# EAGLE design zigbee_iNEMO (EAGLE 9.6.0)

## Sheet 1 of 3
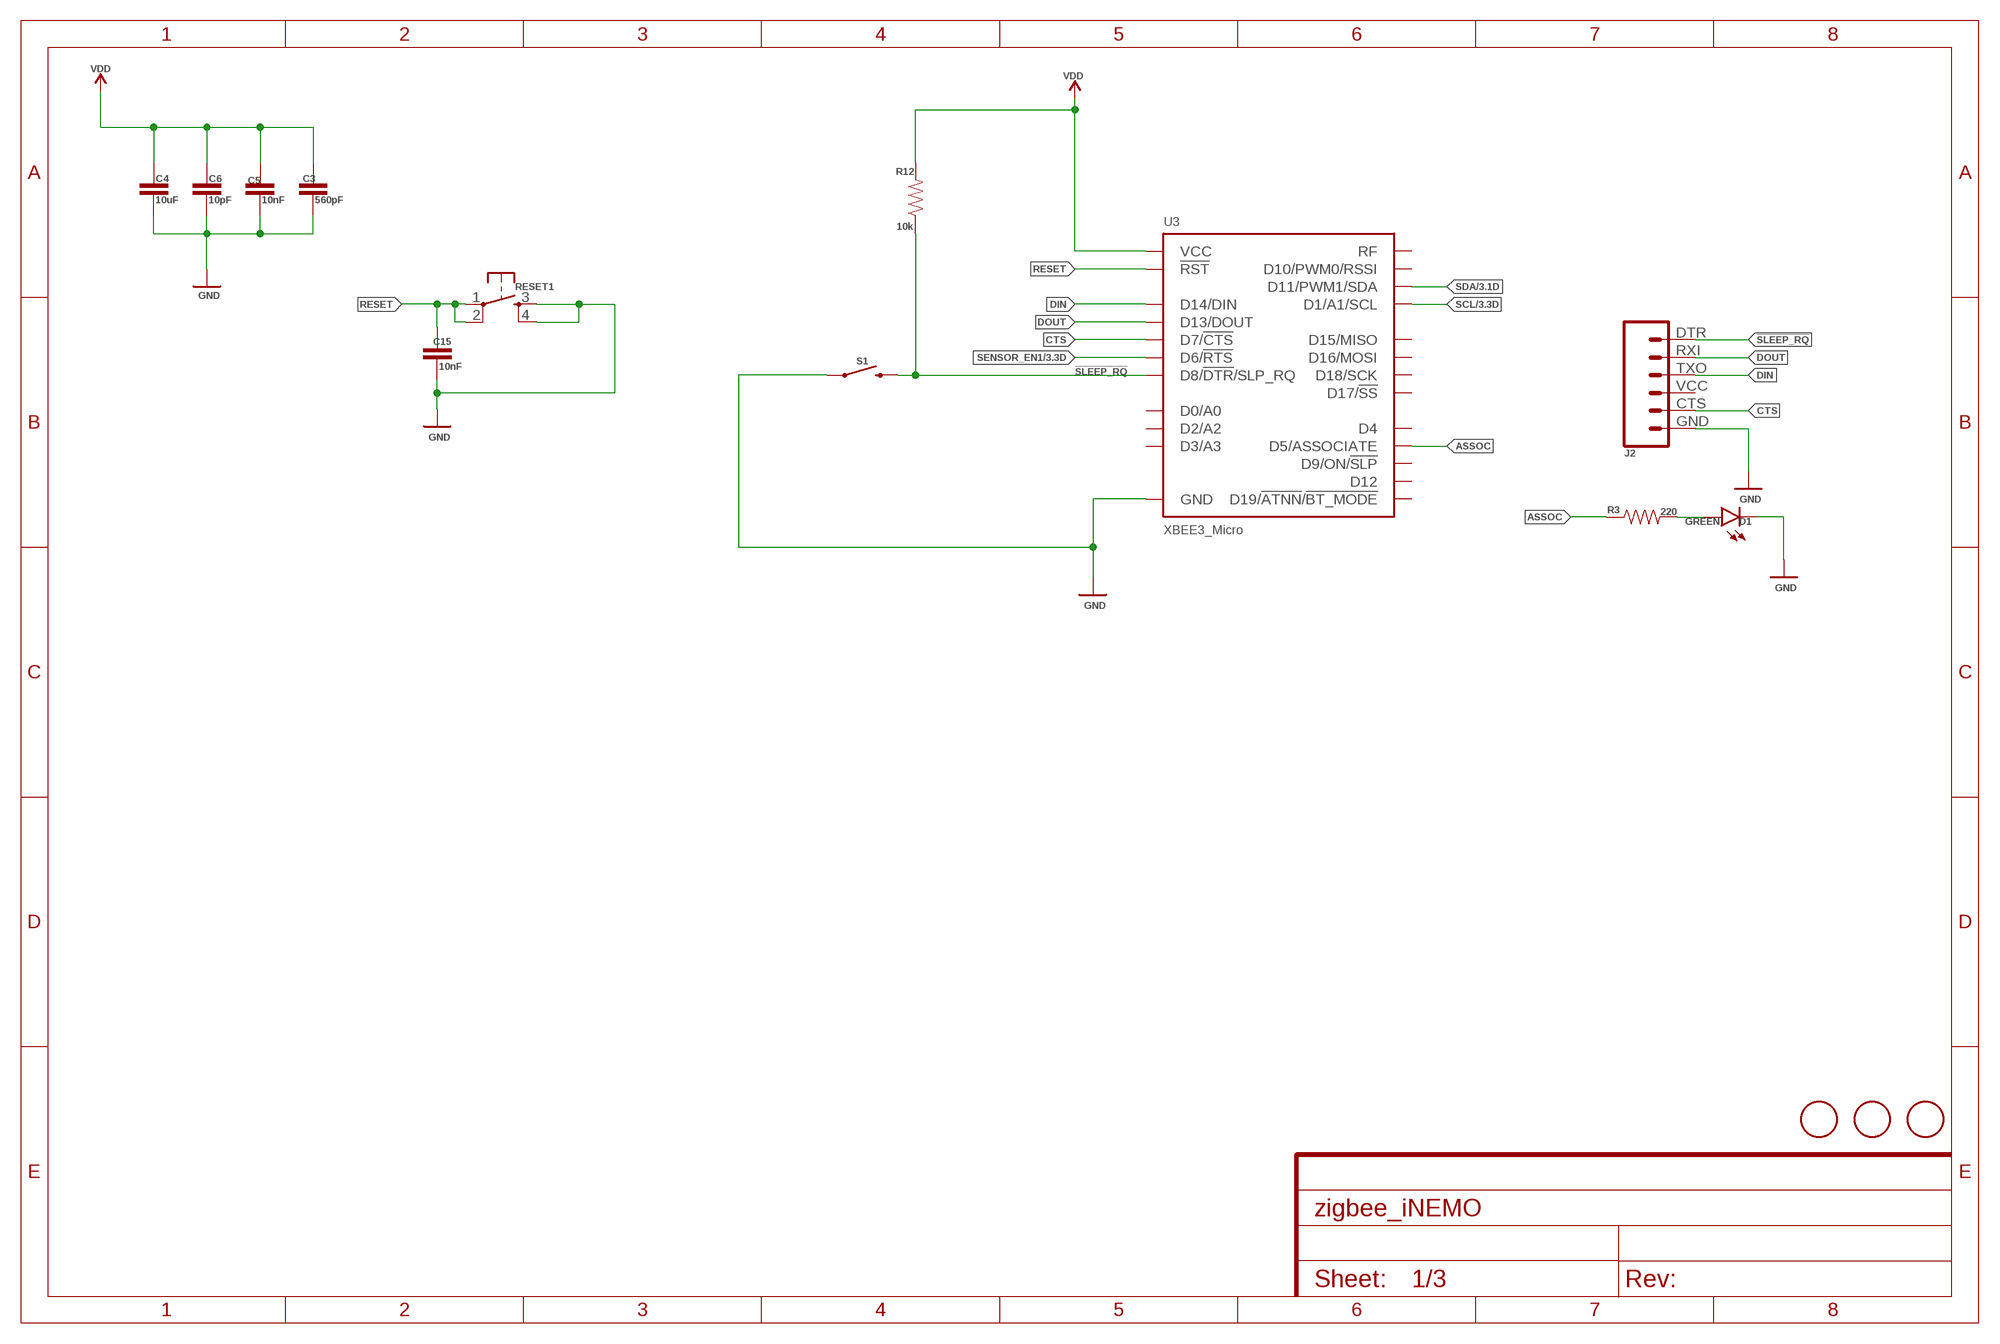
[diagram p0: schematic, sheet 1]

### Parts
C3  560pF  560PF-0603-50V-5%  [0603]
C4  10uF  10UF-0603-6.3V-20%  [0603]
C5  10nF  10NF-0603-50V-10%  [0603]
C6  10pF  10PF-0603-50V-5%  [0603]
C15  10nF  10NF-0603-50V-10%  [0603]
D1  GREEN  LED-GREEN0603  [LED-0603]
J2  6_PIN_SERIAL_CABLEPTH  [FTDI_BASIC]
R3  220  220OHM-0603-1/10W-1%  [0603]
R12  10k  10KOHM-0603-1/10W-1%  [0603]
RESET1  MOMENTARY-SWITCH-SPST-2-SMD-4.6X2.8MM  [TACTILE_SWITCH_SMD_4.6X2.8MM]
S1  MOMENTARY-SWITCH-SPST-SMD-4.6X2.8MM  [TACTILE_SWITCH_SMD_4.6X2.8MM]
U3  XBEE3_Micro  XBEE3_THING_PLUS_SPARKFUN-RF_XBEE3  [XBEE3_THING_PLUS_SPARKFUN-RF_XBEE3]
U$5  FIDUCIAL  [FIDUCIAL_1MM]
U$6  FIDUCIAL  [FIDUCIAL_1MM]
U$7  FIDUCIAL  [FIDUCIAL_1MM]

### Nets
!SLEEP_RQ: J2.DTR R12.1 S1.3 S1.4 U3.P$9(D8/!DTR!/SLP_RQ)
ASSOC: R3.1 U3.P$26(D5/ASSOCIATE)
CTS: J2.CTS U3.P$24(D7/!CTS)
DIN: J2.TXO U3.P$4(D14/DIN)
DOUT: J2.RXI U3.P$3(D13/DOUT)
GND: C3.1 C4.1 C5.1 C6.1 C15.1 D1.C J2.GND RESET1.3 RESET1.4 S1.1 S1.2 U3.P$1(GND) U3.P$10(GND) U3.P$12(GND) U3.P$21(GND) U3.P$32(GND) U3.P$34(GND) ; also sheet 2,3
N$1: D1.A R3.2
RESET: C15.2 RESET1.1 RESET1.2 U3.P$6(!RST)
SCL: U3.P$30(D1/A1/SCL) ; also sheet 3
SDA: U3.P$8(D11/PWM1/SDA) ; also sheet 3
SENSOR_EN1: U3.P$27(D6/!RTS) ; also sheet 3
VDD: C3.2 C4.2 C5.2 C6.2 R12.2 U3.P$2(VCC) ; also sheet 2,3
Unconnected: J2.VCC U3.P$5(D12) U3.P$7(D10/PWM0/RSSI) U3.P$11(D19/!ATNN!/!BT_MODE) U3.P$13(D18/SCK) U3.P$14(D17/!SS) U3.P$15(D16/MOSI) U3.P$16(D15/MISO) U3.P$23(D4) U3.P$25(D9/ON/!SLP) U3.P$28(D3/A3) U3.P$29(D2/A2) U3.P$31(D0/A0) U3.P$33(RF)

## Sheet 2 of 3
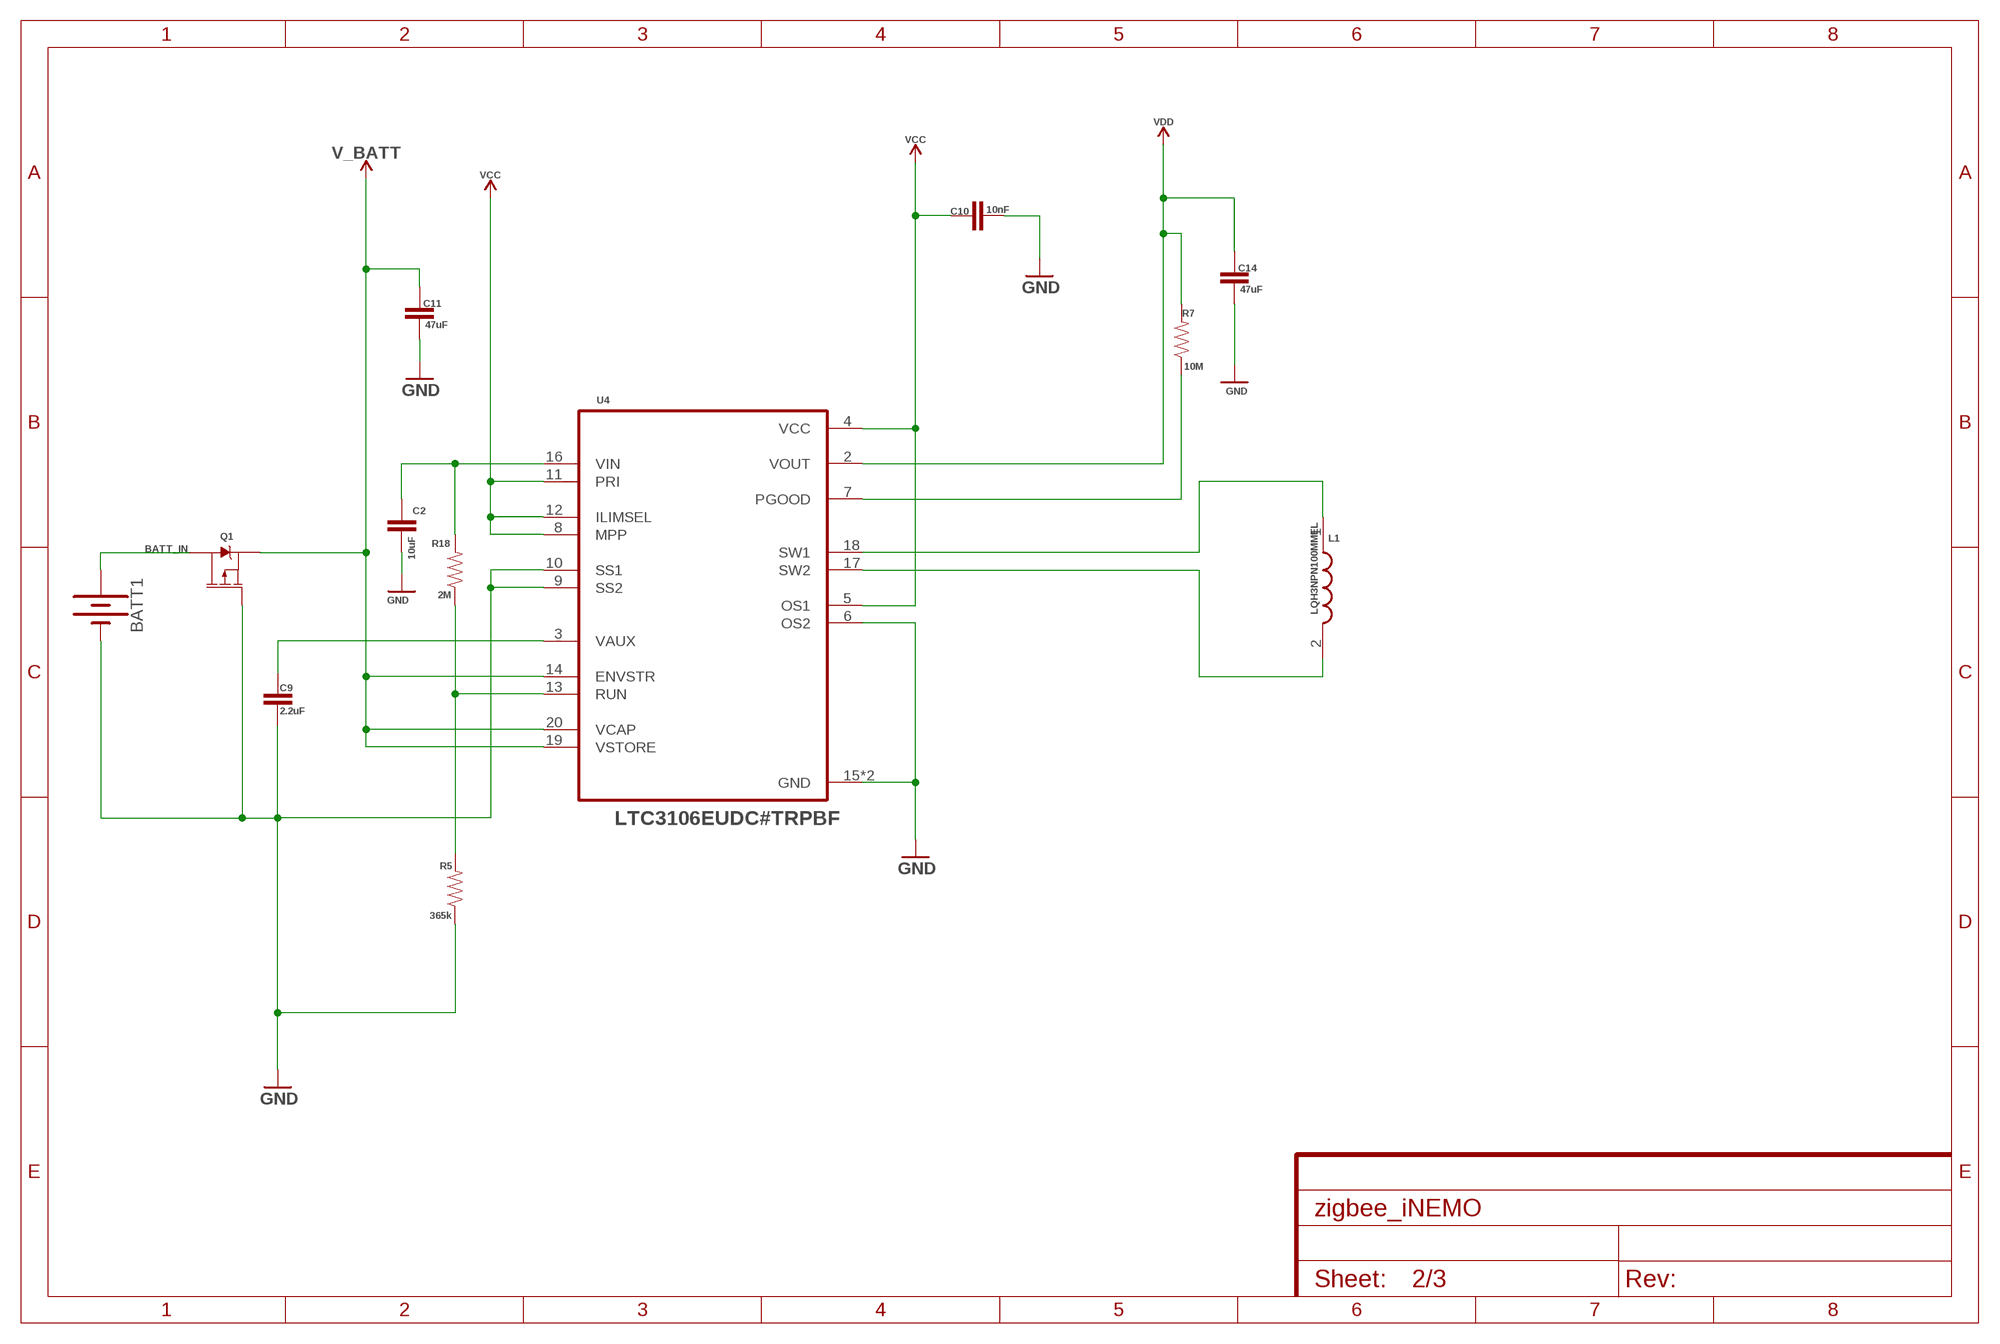
[diagram p1: schematic, sheet 2]

### Parts
BATT1  KEYSTONE_54KEYSTONE_2  [KEYSTONE_V2]
C2  10uF  10UF-0603-6.3V-20%  [0603]
C9  2.2uF  2.2UF-0603-10V-20%  [0603]
C10  10nF  10NF-0603-50V-10%  [0603]
C11  47uF  4.7UF0603  [0603]
C14  47uF  4.7UF0603  [0603]
L1  LQH3NPN100MMEL  [INDPM3030X150N]
Q1  2.5A/30V/105mΩ  MOSFET_PCH-DMG2307L  [SOT23-3]
R5  365k  348KOHM-0603-1/10W-1%  [0603]
R7  10M  10MOHM-0603-1/10W-5%  [0603]
R18  2M  1MOHM-0603-1/4W-5%  [0603]
U4  LTC3106EUDC#TRPBF  [QFN50P400X300X80-21N]

### Nets
BATT_IN: BATT1.P$1(+) BATT1.P$2(+) BATT1.P$3(+) Q1.3(D)
GND: BATT1.P$4(-) BATT1.P$5(-) BATT1.P$6(-) C2.2 C9.2 C10.2 C11.2 C14.2 Q1.1(G) R5.1 U4.6(OS2) U4.9(SS2) U4.10(SS1) U4.15(GND) U4.21(GND) ; also sheet 1,3
N$2: L1.1 U4.18(SW1)
N$3: L1.2 U4.17(SW2)
N$4: R7.1 U4.7(PGOOD)
N$7: C9.1 U4.3(VAUX)
N$9: C2.1 R18.2 U4.16(VIN)
N$10: R5.2 R18.1 U4.13(RUN)
V_BATT: C11.1 Q1.2(S) U4.14(ENVSTR) U4.19(VSTORE) U4.20(VCAP)
VCC: C10.1 U4.4(VCC) U4.5(OS1) U4.8(MPP) U4.11(PRI) U4.12(ILIMSEL)
VDD: C14.1 R7.2 U4.2(VOUT) ; also sheet 1,3

## Sheet 3 of 3
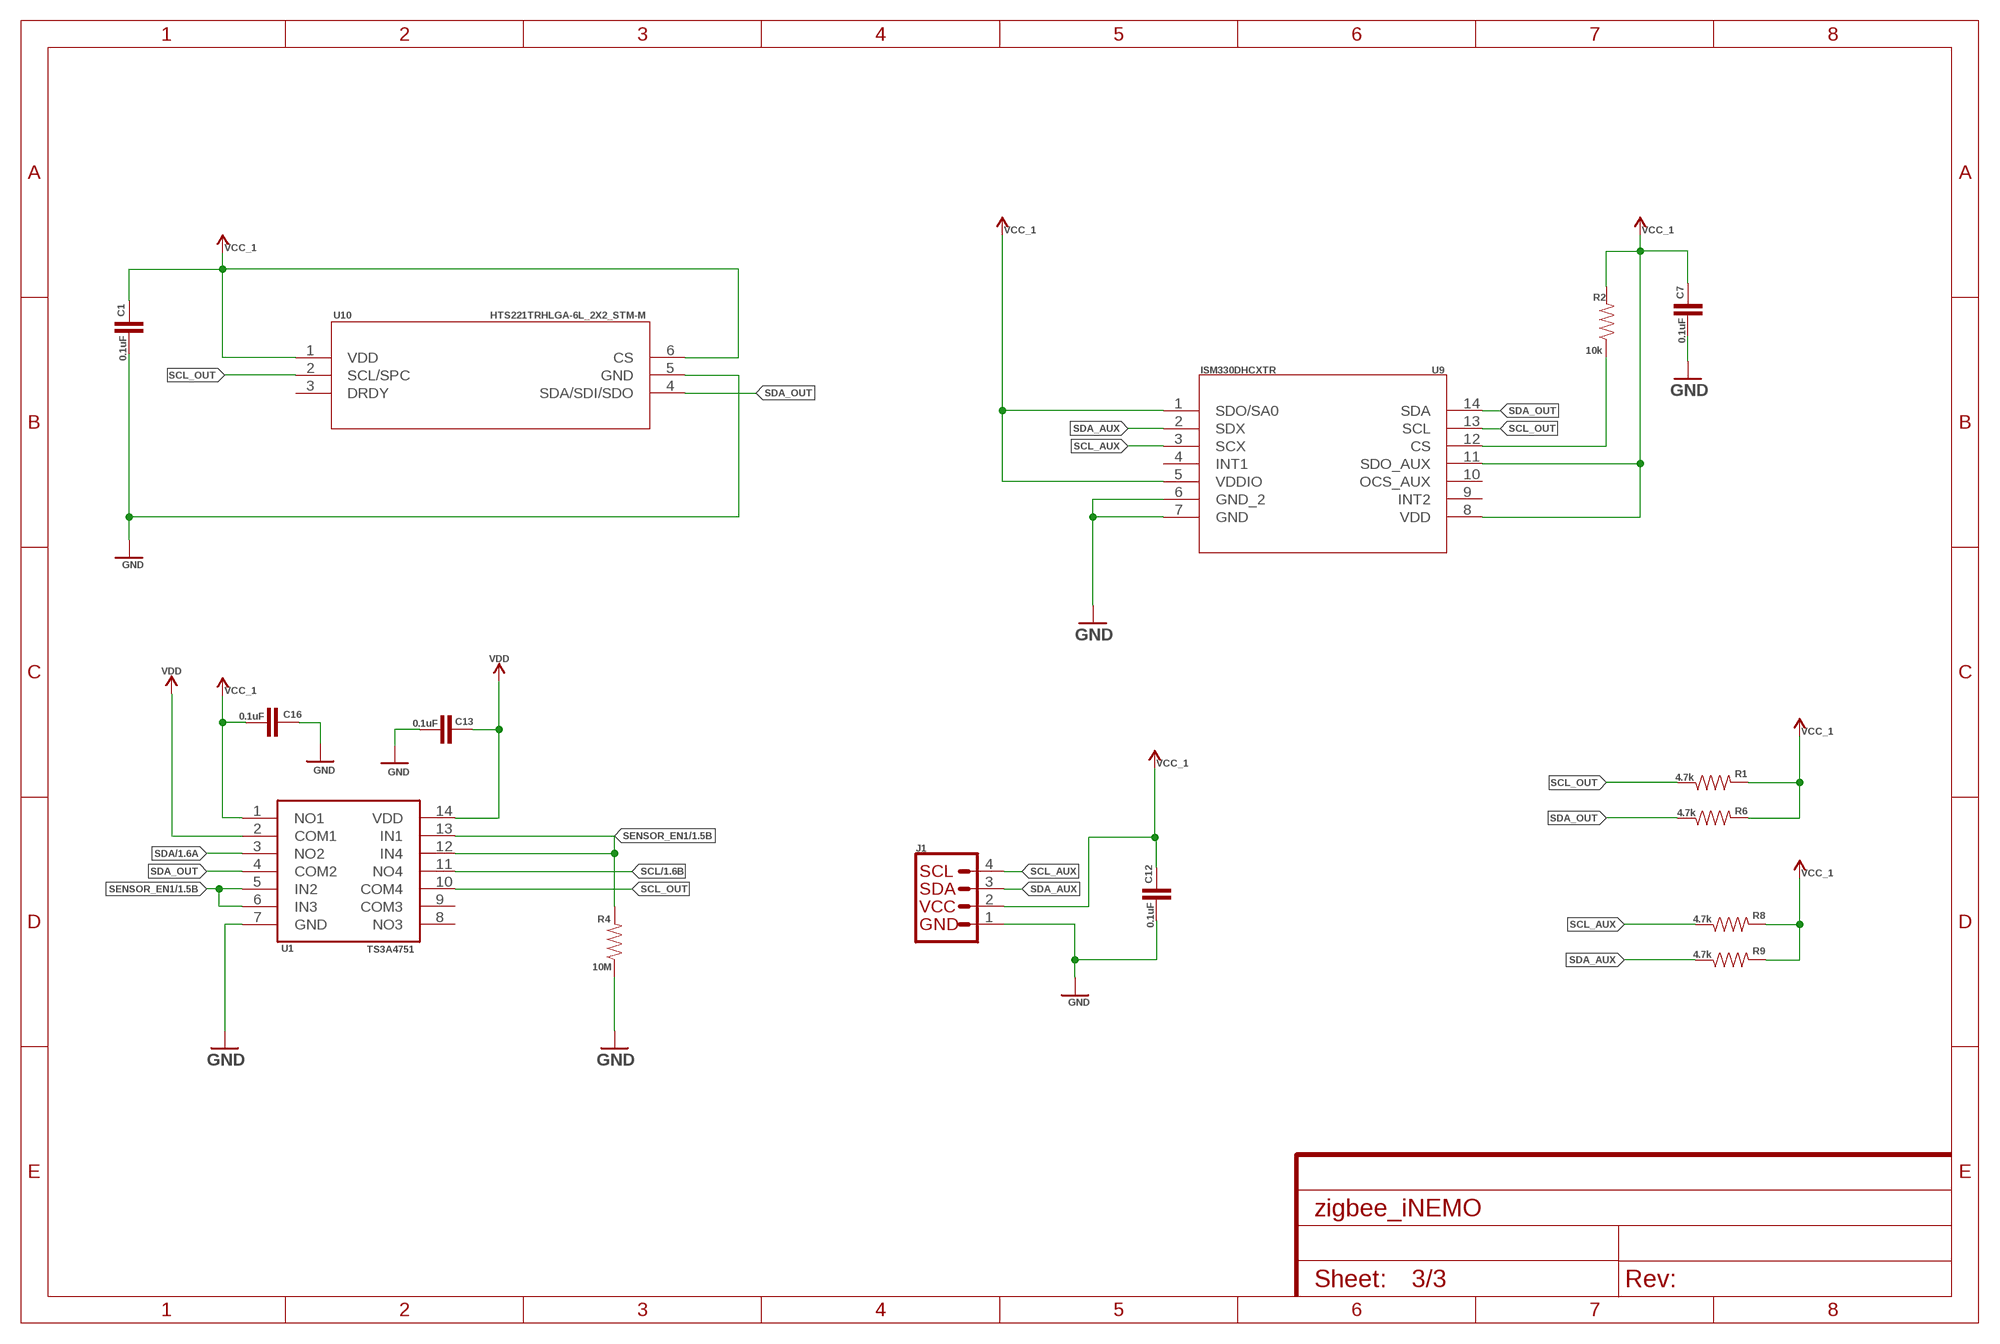
[diagram p2: schematic, sheet 3]

### Parts
C1  0.1uF  0.1UF-0603-25V-(+80/-20%)  [0603]
C7  0.1uF  0.1UF-0603-25V-(+80/-20%)  [0603]
C12  0.1uF  0.1UF-0603-25V-(+80/-20%)  [0603]
C13  0.1uF  0.1UF-0603-25V-(+80/-20%)  [0603]
C16  0.1uF  0.1UF-0603-25V-(+80/-20%)  [0603]
J1  I2C_STANDARD  [1X04]
R1  4.7k  4.7KOHM-0603-1/10W-1%  [0603]
R2  10k  10KOHM-0603-1/10W-1%  [0603]
R4  10M  10MOHM-0603-1/10W-5%  [0603]
R6  4.7k  4.7KOHM-0603-1/10W-1%  [0603]
R8  4.7k  4.7KOHM-0603-1/10W-1%  [0603]
R9  4.7k  4.7KOHM-0603-1/10W-1%  [0603]
U1  TS3A4751  [14_PIN]
U9  ISM330DHCXTR  [QFN_DHCXTR_STM]
U10  HTS221TRHLGA-6L_2X2_STM-M  [HLGA-6L_2X2_STM-M]

### Nets
GND: C1.2 C7.2 C12.2 C13.2 C16.1 J1.1 R4.1 U1.7(GND) U9.6(GND_2) U9.7(GND) U10.5(GND) ; also sheet 1,2
N$5: R2.1 U9.12(CS)
SCL: U1.11(NO4) ; also sheet 1
SCL_AUX: J1.4 R8.1 U9.3(SCX)
SCL_OUT: R1.1 U1.10(COM4) U9.13(SCL) U10.2(SCL/SPC)
SDA: U1.3(NO2) ; also sheet 1
SDA_AUX: J1.3 R9.1 U9.2(SDX)
SDA_OUT: R6.1 U1.4(COM2) U9.14(SDA) U10.4(SDA/SDI/SDO)
SENSOR_EN1: R4.2 U1.5(IN2) U1.6(IN3) U1.12(IN4) U1.13(IN1) ; also sheet 1
VCC_1: C1.1 C7.1 C12.1 C16.2 J1.2 R1.2 R2.2 R6.2 R8.2 R9.2 U1.1(NO1) U9.1(SDO/SA0) U9.5(VDDIO) U9.8(VDD) U9.11(SDO_AUX) U10.1(VDD) U10.6(CS)
VDD: C13.1 U1.2(COM1) U1.14(VDD) ; also sheet 1,2
Unconnected: U1.8(NO3) U1.9(COM3) U9.4(INT1) U9.9(INT2) U9.10(OCS_AUX) U10.3(DRDY)

## Library data of the parts
BATT1 = battery_54:KEYSTONE_54
C1 C7 C12 C13 C16 = SparkFun-Capacitors:0.1UF: 0.1µF ceramic capacitors A capacitor is a passive two-terminal electrical component used to store electrical energy temporarily in an electric field.; PROD_ID: CAP-00810
C2 C4 = SparkFun-Capacitors:10UF: 10.0µF ceramic capacitors A capacitor is a passive two-terminal electrical component used to store electrical energy temporarily in an electric field.; PROD_ID: CAP-11015
C3 = SparkFun-Capacitors:560PF: 0.56nF/560pF ceramic capacitors A capacitor is a passive two-terminal electrical component used to store electrical energy temporarily in an electric field.; PROD_ID: CAP-08749
C5 C10 C15 = SparkFun-Capacitors:10NF: 0.01uF/10nF/10,000pF ceramic capacitors A capacitor is a passive two-terminal electrical component used to store electrical energy temporarily in an electric field. CAP-09321; PROD_ID: CAP-00867
C6 = SparkFun-Capacitors:10PF: 10pF ceramic capacitors A capacitor is a passive two-terminal electrical component used to store electrical energy temporarily in an electric field.; PROD_ID: CAP-11812
C9 = SparkFun-Capacitors:2.2UF: 2.2µF ceramic capacitors A capacitor is a passive two-terminal electrical component used to store electrical energy temporarily in an electric field.; PROD_ID: CAP-07888
C11 C14 = SparkFun-Capacitors:4.7UF: 4.7µF ceramic capacitors A capacitor is a passive two-terminal electrical component used to store electrical energy temporarily in an electric field.; PROD_ID: CAP-08280; VALUE: 4.7uF
D1 = SparkFun-LED:LED-GREEN: Green SMD LED Used in manufacturing of various products at SparkFun Packages: 0603 - SMD 0603 package [Product Link] <http://www.futureelectronics.com/en/technologies/semiconductors/optoelectronics/leds/Pages/9894312-LTST-C190GKT.aspx?CrossPart=HSMG-C190&IM=0> LilyPad 1206 - SMD1206 LilyPad package [Product Link] <http://www.futureelectronics.com/en/Technologies/Product.aspx?ProductID=IN150NGHARVATEKCORPORATION2049943&IM=0> 1206 - SMD1206 package [Product Link] <http://www.futureelectronics.com/en/technologies/semiconductors/optoelectronics/leds/Pages/8315665-LTST-C150KGKT.aspx?IM=0> 1206 Bottom Mount -SMD 1206 Bottom Mount [Product Link] <http://www.digikey.com/product-detail/en/lite-on-inc/LTST-C230KGKT/160-1456-1-ND/386854> SparkFun Products: Pro Mini 328 -5V <https://www.sparkfun.com/products/821> RedBoard <https://www.sparkfun.com/products/12757> MP3 Trigger <https://www.sparkfun.com/products/13720> Makey Makey <https://www.sparkfun.com/products/11076>; PROD_ID: DIO-00821
J1 = SparkFun-Connectors:I2C_STANDARD: SparkFun I2C Standard Pinout Header SparkFun has standardized on a pinout for all I2C based sensor breakouts. This pinout allows I2C boards to be plugged directly into the headers on Arduino Uno compatible boards, and to be daisy chained easily. Example SparkFun Products: SparkFun Atmospheric Sensor Breakout - BME280 <https://www.sparkfun.com/products/13676> SparkFun Altitude/Pressure Sensor Breakout - MPL3115A2 <https://www.sparkfun.com/products/11084> SparkFun TOF Range Finder Sensor - VL6180 <https://www.sparkfun.com/products/12785>
J2 = SparkFun-Connectors:6_PIN_SERIAL_CABLE: 6-pin header connection for use with the "FTDI BASIC" pinout - CABLE SIDE. Also known as "Arduino Serial Program Header". This is used on a design to provide a 6-pin connection point for serial communication usually from a USB cable (D+/D-) to these headers (RX/TX). It also has the remaining pins necessary for programming in the Arduino evironment (DTR, GND, and sometimes VCC). Note, this device has "CABLE" in the name. It is intended to be used on a design that usually lives on the end of your USB cable and prvides the converter chip (FTDI232 or FTDI231x) to commnicate serial RX/TX. The "sister" device, named "TARGET" is inteneded to be used on a design that contains a target micro-controller that you wish to program. You can populate with some of these: Female Headers <https://www.sparkfun.com/products/115> (PRT-00115) For reference (or to suit your programming needs) check out these designs: SparkFun FTDI Basic Breakout - 5V <https://www.sparkfun.com/products/9716> (DEV-09716) SparkFun FTDI Basic Breakout - 3.3V <https://www.sparkfun.com/products/9873> (DEV-09873) SparkFun FTDI SmartBasic <https://www.sparkfun.com/products/12935> (DEV-12935) SparkFun Beefy 3 - FTDI Basic Breakout <https://www.sparkfun.com/products/13746> (DEV-13746)
L1 = SamacSys_Parts:LQH3NPN100MMEL: Fixed Inductors 10uH 1280mA 0.228ohm SRF=20MHz(min) Source: Datasheet <https://componentsearchengine.com/Datasheets/1/LQH3NPN100MMEL.pdf>; DESCRIPTION: Fixed Inductors 10uH 1280mA 0.228ohm SRF=20MHz(min); HEIGHT: 1.5mm; MANUFACTURER_NAME: Murata Electronics; MANUFACTURER_PART_NUMBER: LQH3NPN100MMEL; MOUSER_PART_NUMBER: 81-LQH3NPN100MMEL; MOUSER_PRICE-STOCK: https://www.mouser.com/Search/Refine.aspx?Keyword=81-LQH3NPN100MMEL
Q1 = SparkFun-DiscreteSemi:MOSFET_PCH: P-channel MOSFETs Voltage controlled devices that allow control of high current outputs. SparkFun Products: SparkFun ESP32 Thing <https://www.sparkfun.com/products/13907> SparkFun ESP8266 Thing <https://www.sparkfun.com/products/13231>; PROD_ID: TRANS-11308
R1 R6 R8 R9 = SparkFun-Resistors:4.7KOHM: 4.7kΩ resistor A resistor is a passive two-terminal electrical component that implements electrical resistance as a circuit element. Resistors act to reduce current flow, and, at the same time, act to lower voltage levels within circuits. - Wikipedia; PROD_ID: RES-07857
R2 R12 = SparkFun-Resistors:10KOHM: 10kΩ resistor A resistor is a passive two-terminal electrical component that implements electrical resistance as a circuit element. Resistors act to reduce current flow, and, at the same time, act to lower voltage levels within circuits. - Wikipedia; PROD_ID: RES-00824
R3 = SparkFun-Resistors:220OHM: 220Ω resistor A resistor is a passive two-terminal electrical component that implements electrical resistance as a circuit element. Resistors act to reduce current flow, and, at the same time, act to lower voltage levels within circuits. - Wikipedia; PROD_ID: RES-07861
R4 R7 = SparkFun-Resistors:10MOHM: RES-09327; PROD_ID: RES-08283
R5 = SparkFun-Resistors:348KOHM: 348kΩ resistor A resistor is a passive two-terminal electrical component that implements electrical resistance as a circuit element. Resistors act to reduce current flow, and, at the same time, act to lower voltage levels within circuits. - Wikipedia; PROD_ID: RES-12533; VALUE: 348k
R18 = SparkFun-Resistors:1MOHM: 1MΩ resistor A resistor is a passive two-terminal electrical component that implements electrical resistance as a circuit element. Resistors act to reduce current flow, and, at the same time, act to lower voltage levels within circuits. - Wikipedia; PROD_ID: RES-07868; VALUE: 1M
RESET1 = SparkFun-Switches:MOMENTARY-SWITCH-SPST-2: Momentary Switch (Pushbutton) - SPST - Two Circuits Normally-open (NO) SPST momentary switches (buttons, pushbuttons). Schematic symbol includes two switch circuits. Variants SMD-4.6MMX2.8MM - 4.60mm x 2.80mm Tactile Momentary Button Switch - Used on SparkFun SAMD21 Mini Breakout <https://www.sparkfun.com/products/13664> SMD-5.2MM - Mini Pushbutton Switch - SMD <https://www.sparkfun.com/products/8720> - Used on Arduino Pro Mini <https://www.sparkfun.com/products/11114>; PROD_ID: SWCH-13065
S1 = SparkFun-Switches:MOMENTARY-SWITCH-SPST: Momentary Switch (Pushbutton) - SPST Normally-open (NO) SPST momentary switches (buttons, pushbuttons). Variants PTH-12MM - 12mm square, through-hole Momentary Pushbutton Switch - 12mm Square <https://www.sparkfun.com/products/9190> (COM-09190) PTH-6.0MM, PTH-6.0MM-KIT - 6.0mm square, through-hole Mini Pushbutton Switch <https://www.sparkfun.com/products/97> (COM-00097) KIT package intended for soldering kit's - only one side of pads' copper is exposed. PTH-RIGHT-ANGLE-KIT - Right-angle, through-hole Right Angle Tactile Button <https://www.sparkfun.com/products/10791> - Used on SparkFun BigTime Watch Kit <https://www.sparkfun.com/products/11734> SMD-12MM - 12mm square, surface-mount Tactile Button - SMD (12mm) <https://www.sparkfun.com/products/12993> (COM-12993) Used on SparkFun PicoBoard <https://www.sparkfun.com/products/11888> SMD-4.5MM - 4.5mm Square Trackball Switch Used on SparkFun Blackberry Trackballer Breakout <https://www.sparkfun.com/products/13169> SMD-4.6MMX2.8MM - 4.60mm x 2.80mm, surface mount Used on SparkFun SAMD21 Mini Breakout <https://www.sparkfun.com/products/13664> SMD-5.2MM, SMD-5.2-REDUNDANT - 5.2mm square, surface-mount Mini Pushbutton Switch - SMD <https://www.sparkfun.com/products/8720> (COM-08720) Used on Arduino Pro Mini <https://www.sparkfun.com/products/11114> REDUNDANT package connects both switch circuits together SMD-6.0X3.5MM - 6.0 x 3.5mm, surface mount Momentary Reset Switch SMD <https://www.sparkfun.com/products/8229> (COM-08229) SMD-6.2MM-TALL - 6.2mm square, surface mount Tactile Button - SMD (6mm) <https://www.sparkfun.com/products/12992> Used on SparkFun Digital Sandbox <https://www.sparkfun.com/products/12651> SMD-RIGHT-ANGLE - Right-angle, surface mount Used on SparkFun Block for Intel® Edison - Arduino <https://www.sparkfun.com/products/13036>; PROD_ID: SWCH-13065
U1 = TS3A4751:TS3A4751: TS3A4751 Quad Switch; AVAILABILITY: Unavailable; DESCRIPTION: 0.9 Ohm Low-Voltage Single-Supply Quad SPST Analog Switch; MF: Texas Instruments; MP: TS3A4751; PACKAGE: TSSOP-14 Texas Instruments; PRICE: None
U3 = starview_mini_v7:XBEE3_THING_PLUS_SPARKFUN-RF_XBEE3; PROD_ID: WRL-14444/WRL-14467
U4 = LTC3106EUDC_TRPBF:LTC3106EUDC#TRPBF: LTC3106 - 300mA Low Voltage Buck-Boost Converter with PowerPath and 1.6μA Quiescent Current; AVAILABILITY: Unavailable; DESCRIPTION: LTC3106 - 300mA Low Voltage Buck-Boost Converter with PowerPath and 1.6μA Quiescent Current; MF: Linear Technology/Analog; MP: LTC3106EUDC#TRPBF; PACKAGE: QFN-20 Linear Technology; PRICE: None
U9 = ISM330DHCX:ISM330DHCXTR; BUILT_BY: EMA_Matt; COPYRIGHT: Copyright (C) 2018 Accelerated Designs. All rights reserved; DATASHEET: https://www.st.com/resource/en/datasheet/ism330dhcx.pdf; MANUFACTURER_PART_NUMBER: ISM330DHCXTR; SOURCELIBRARY: Add_to_database_2020-11-05; VENDOR: STMicroelectronics
U10 = HTS221:HTS221TR; BUILT_BY: EMA_Anthony; COPYRIGHT: Copyright (C) 2018 Accelerated Designs. All rights reserved; DATASHEET: https://www.st.com/content/ccc/resource/technical/document/datasheet/4d/9a/9c/ad/25/07/42/34/DM00116291.pdf/files/DM00116291.pdf/jcr:content/translations/en.DM00116291.pdf; MANUFACTURER_PART_NUMBER: HTS221TR; SOURCELIBRARY: Updates_to_database_2020-11-03; VENDOR: STMicroelectronics
U$5-U$7 = adafruit:FIDUCIAL: For use by pick and place machines to calibrate the vision/machine, 1mm By microbuilder.eu

## Board
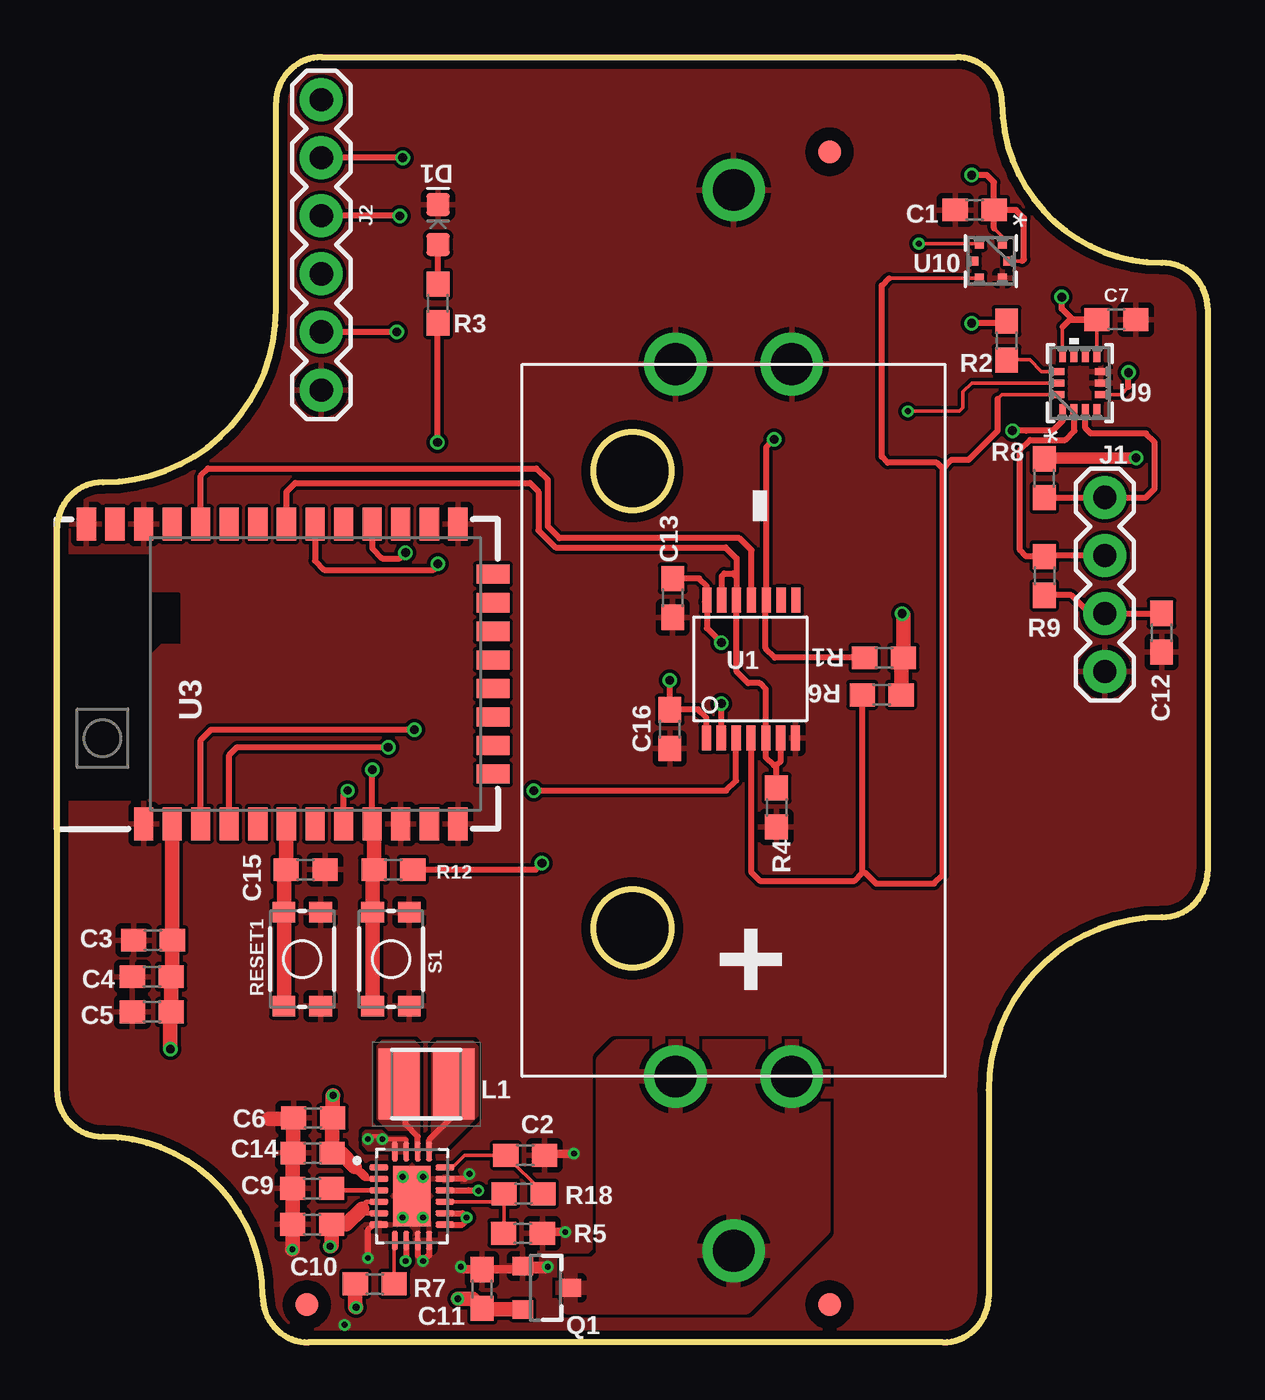
[diagram p3: board, top side]
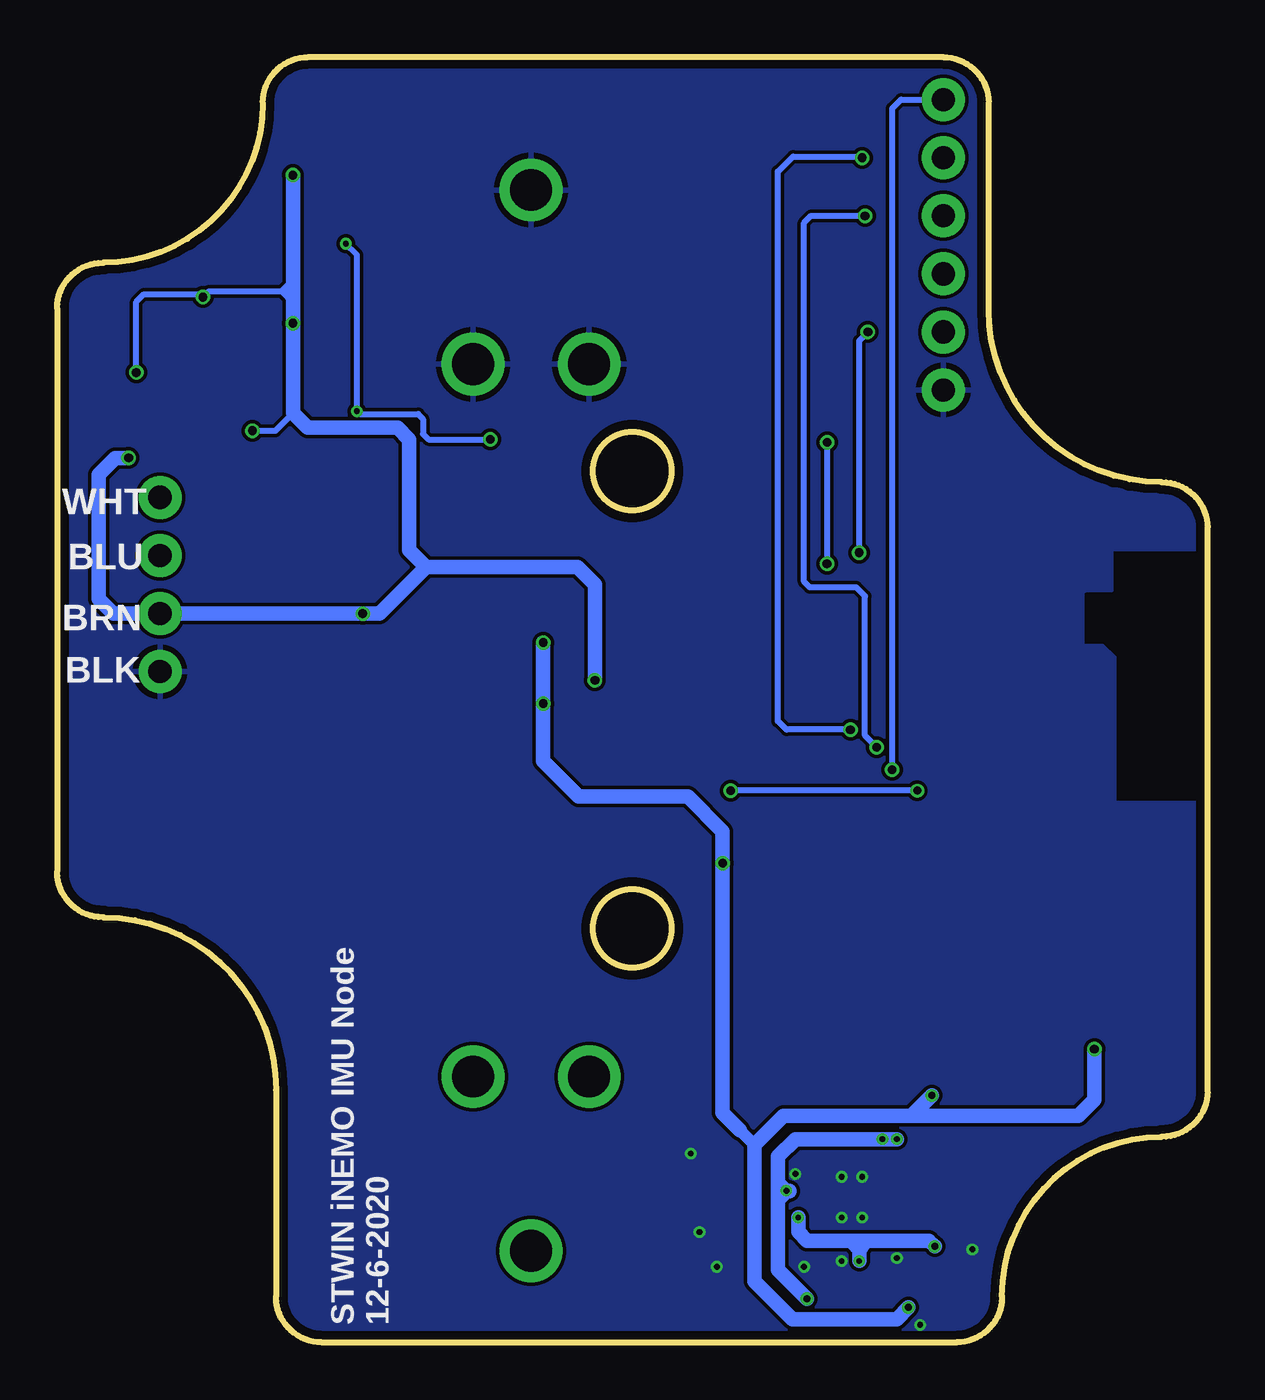
[diagram p4: board, bottom side, seen from below]

Size 50.32 x 56.21 mm. Coordinates in mm from the lower left corner, seen from the top.
Outline: 41.33,54.22 41.33,54.19 arc90 48.3,47.22 48.33,47.22 arc-90 50.32,45.23 50.32,20.59 arc-90 48.33,18.59 48.3,18.59 arc90 40.75,11.04 40.75,2 arc-90 38.75,0 10.99,0 arc-90 8.99,2 8.99,2.02 arc90 2.02,8.99 2,8.99 arc-90 0,10.99 0,35.63 arc-90 2,37.62 2.02,37.62 arc90 9.58,45.18 9.58,54.22 arc-90 11.57,56.22 39.33,56.22 arc-90 41.33,54.22
Outline: circle at 25.16,18.11 radius 1.71
Outline: circle at 25.16,38.11 radius 1.71
Copper layers (1*16): Top 0.035559375mm / dielectric 1.6mm / Bottom 0.035559375mm
Design rules "oshpark-2layer": minimum track width 6mil, minimum drill 10mil, track to track 6mil, track to pad 6mil, pad to pad 6mil, via to via 6mil, smd to smd 6mil, copper to edge 15mil, drill to drill 6mil, minimum pad ring 5mil, minimum via ring 5mil, stop-mask expansion 2.5mil, vias tented up to drill 0mil, thermal gap 10mil

### Footprints (pad centres in the part's own frame; a part is rotated, then mirrored left to right if it is on the bottom)
KEYSTONE_V2 = drill 1.829: P$1 15.58,2.54; P$2 15.58,-2.54; P$3 23.2,0; P$4 -15.58,2.54; P$5 -15.58,-2.54; P$6 -23.2,0
0603 = smd 1.1 x 1: 1 -0.85,0; 2 0.85,0
LED-0603 = smd 1 x 1: A -0.877,0; C 0.877,0
1X04 = drill 1.016 pad 1.88: 1 0,0; 2 2.54,0; 3 5.08,0; 4 7.62,0
FTDI_BASIC = drill 1.016 pad 1.88: CTS 10.16,0; DTR 0,0; GND 12.7,0; RXI 2.54,0; TXO 5.08,0; VCC 7.62,0
INDPM3030X150N = smd 1.8 x 3.1: 1 -1.2,0; 2 1.2,0
SOT23-3 = smd 0.8 x 0.9: 1 -0.95,-1; 2 0.95,-1; 3 0,1.1
TACTILE_SWITCH_SMD_4.6X2.8MM = smd 0.9 x 1: 1 -2.05,-0.8; 2 2.05,-0.8; 3 2.05,0.8; 4 -2.05,0.8
14_PIN = smd 1.1 x 0.4: 1 -3.26,1.165; 2 -3.26,0.515; 3 -3.26,-0.135; 4 -3.26,-0.785; 5 -3.26,-1.435; 6 -3.26,-2.085; 7 -3.26,-2.735; 8 2.77,-2.755; 9 2.77,-2.105; 10 2.77,-1.455; 11 2.77,-0.805; 12 2.77,-0.155; 13 2.77,0.495; 14 2.77,1.145
XBEE3_THING_PLUS_SPARKFUN-RF_XBEE3 = smd 1.448 x 0.838: P$1 -6.553,5.847; P$2 -6.553,4.597; P$3 -6.553,3.348; P$4 -6.553,2.098; P$5 -6.553,0.848; P$6 -6.553,-0.401; P$7 -6.553,-1.651; P$8 -6.553,-2.901; P$9 -6.553,-4.15; P$10 -6.553,-5.4; P$11 -6.553,-6.65; P$12 -6.553,-7.899; P$21 6.553,-7.899; P$22 6.553,-6.65; P$23 6.553,-5.4; P$24 6.553,-4.15; P$25 6.553,-2.901; P$26 6.553,-1.651; P$27 6.553,-0.401; P$28 6.553,0.848; P$29 6.553,2.098; P$30 6.553,3.348; P$31 6.553,4.597; P$32 6.553,5.847; P$33 6.553,7.097; P$34 6.553,8.346 | smd 0.838 x 1.448: P$13 -4.381,-9.436; P$14 -3.132,-9.436; P$15 -1.882,-9.436; P$16 -0.632,-9.436; P$17 0.617,-9.436; P$18 1.867,-9.436; P$19 3.117,-9.436; P$20 4.366,-9.436
QFN50P400X300X80-21N = smd 0.84 x 0.27: 1 -1.445,1.25; 2 -1.445,0.75; 3 -1.445,0.25; 4 -1.445,-0.25; 5 -1.445,-0.75; 6 -1.445,-1.25; 11 1.445,-1.25; 12 1.445,-0.75; 13 1.445,-0.25; 14 1.445,0.25; 15 1.445,0.75; 16 1.445,1.25 | smd 0.27 x 0.84: 7 -0.75,-1.945; 8 -0.25,-1.945; 9 0.25,-1.945; 10 0.75,-1.945; 17 0.75,1.945; 18 0.25,1.945; 19 -0.25,1.945; 20 -0.75,1.945 | smd 1.65 x 2.65: 21 0,0
QFN_DHCXTR_STM = smd 0.533 x 0.305: 1 -1.181,0.75; 2 -1.181,0.25; 3 -1.181,-0.25; 4 -1.181,-0.75; 8 1.181,-0.75; 9 1.181,-0.25; 10 1.181,0.25; 11 1.181,0.75 | smd 0.305 x 0.533: 5 -0.5,-0.933; 6 0,-0.933; 7 0.5,-0.933; 12 0.5,0.933; 13 0,0.933; 14 -0.5,0.933
HLGA-6L_2X2_STM-M = smd 0.406 x 0.406: 1 -0.749,0.5; 2 -0.749,-0.5; 3 0,-0.749; 4 0.749,-0.5; 5 0.749,0.5; 6 0,0.749
FIDUCIAL_1MM = smd 1 x 1: 1 0,0

### Placement (x,y rotation side)
BATT1  29.59,27.2 270 top
C1  40.13,49.53 180 top
C2  20.47,8.18 0 top
C3  4.19,17.59 0 top
C4  4.14,16 0 top
C5  4.14,14.45 0 top
C6  11.2,9.81 0 top
C7  46.33,44.73 0 top
C9  11.15,6.73 180 top
C10  11.15,5.16 180 top
C11  18.59,2.34 90 top
C12  48.31,31.04 270 top
C13  26.92,32.56 270 top
C14  11.18,8.28 180 top
C15  10.87,20.68 180 top
C16  26.8,26.82 90 top
D1  16.66,48.9 90 top
J1  45.82,29.34 90 top
J2  11.56,54.36 270 top
L1  16.15,11.3 0 top
Q1  21.36,2.39 270 top
R1  36.17,29.95 0 top
R2  41.53,43.81 90 top
R3  16.66,45.44 90 top
R4  31.47,23.39 90 top
R5  20.37,4.78 180 top
R6  36.07,28.32 0 top
R7  13.89,2.57 180 top
R8  43.18,37.8 90 top
R9  43.18,33.53 270 top
R12  14.71,20.68 0 top
R18  20.4,6.5 0 top
RESET1  10.72,16.76 270 top
S1  14.61,16.76 90 top
U1  29.57,29.69 90 top
U3  9.63,29.24 90 top
U4  15.52,6.4 0 top
U9  44.73,41.96 90 top
U10  40.84,47.29 270 top
U$5  33.78,52.07 0 top
U$6  10.92,1.65 0 top
U$7  33.78,1.65 0 top

### Tracks (layer width: path | path; a pad name or v marks a point on that pad's centre or on a via)
!SLEEP_RQ  (via drill 0.38)
  Top 0.254: U3.P$9 13.78,25.03 v13.79,25.04
  Top 0.635: S1.4 S1.3 13.8,20.62 R12.1 13.86,22.6 U3.P$9
  Bottom 0.254: v13.79,25.04 13.79,53.98 13.41,54.36 J2.DTR
ASSOC  (via drill 0.38)
  Top 0.254: U3.P$26 11.28,34.19 11.68,33.78 16.46,33.78 16.69,34.01 v16.65,34.05 | v16.64,39.37 16.64,44.56 R3.1
  Bottom 0.254: v16.65,34.05 16.64,34.06 v16.64,39.37
BATT_IN
  pour Top: 22.1,3.17 22.1,1.78 22.35,1.52 30.1,1.52 33.53,4.95 33.53,12.45 33.02,12.95 24.51,12.95 23.88,12.32 23.88,3.81 23.5,3.43 22.35,3.43
CTS  (via drill 0.38)
  Top 0.254: U3.P$24 13.78,34.74 14.22,34.29 14.99,34.29 v15.24,34.54 | v14.86,44.2 J2.CTS
  Bottom 0.254: v15.24,34.54 15.24,43.81 v14.86,44.2
DIN  (via drill 0.38)
  Top 0.254: U3.P$4 7.53,25.69 7.87,26.04 v14.48,26.04 | v14.99,49.28 J2.TXO
  Bottom 0.254: v14.48,26.04 14.99,26.54 14.99,32.64 15.37,33.02 17.4,33.02 17.65,33.27 17.65,48.97 17.35,49.28 v14.99,49.28
DOUT  (via drill 0.38)
  Top 0.254: U3.P$3 6.28,26.34 6.73,26.8 v15.62,26.8 | v15.11,51.82 J2.RXI
  Bottom 0.254: v15.62,26.8 18.41,26.8 18.8,27.18 18.8,51.21 18.14,51.87 15.14,51.87 15.11,51.84 v15.11,51.82
GND  (via drill 0.25)
  Top 0.254: U4.9 15.77,3.79 v16,3.56 16.27,3.82 U4.10 | v18.03,7.37 17.82,7.15 U4.15 | U4.6 13.82,5.15 13.59,4.92 v13.59,3.68 | U4.21 15.11,6.81 v15.11,7.24
  Top 0.381: v17.65,3.3 17.77,3.19 C11.2 21.35,3.19 v21.46,3.3 21.43,3.34 Q1.1 | C2.2 21.4,8.26 v22.61,8.26 | R5.1 21.27,4.83 v22.23,4.83
  Top 0.635: 9.27,9.78 10.32,9.78 C6.1 10.33,9.79 C14.2 10.3,8.26 C9.2 C10.2 10.3,4.08 v10.29,4.06 | 3.27,15.97 C4.1
  other vias: 16,7.24 15.11,5.46 16,5.46 12.57,0.76
  pour Top (rank 6): -0.13,-0.25 -0.13,22.99 0.51,23.62 3.94,23.62 4.19,23.88 4.19,30.1 4.57,30.48 5.46,30.48 5.46,32.77 5.33,32.89 4.19,32.89 4.19,34.54 0.13,34.54 -0.13,34.8 -0.13,56.52 0.51,57.15 49.15,57.15 50.42,55.88 50.8,55.88 50.8,-0.13 50.29,-0.64 0.25,-0.64
  pour Bottom (rank 6): 0,-0.38 0,23.11 0.51,23.62 4.06,23.62 4.06,29.97 4.57,30.48 5.46,30.48 5.46,32.77 5.33,32.89 4.19,32.89 4.19,34.67 0.13,34.67 0,34.54 0,56.64 0.51,57.15 49.4,57.15 50.67,55.88 50.67,-0.25 50.29,-0.64 0.25,-0.64
N$1
  Top 0.254: R3.2 D1.A
N$2
  Top 0.254: U4.18 15.77,9 15.24,9.53 15.24,11.02 L1.1
  pour Top (no thermals): 13.97,12.95 13.97,9.78 14.48,9.27 15.37,9.27 15.62,9.02 15.75,9.02 15.88,9.14 15.88,12.95 15.62,13.21 14.22,13.21
N$3
  Top 0.254: U4.17 16.27,8.85 17.35,9.94 L1.2
  pour Top (no thermals): 16.64,13.21 18.16,13.21 18.41,12.95 18.41,9.91 16.89,8.38 16.38,8.38 16.26,8.51 16.26,9.02 16.38,9.14 16.38,12.95
N$4
  Top 0.152: R7.1 14.74,4.43 U4.7
N$5
  Top 0.152: U9.12 43.06,42.46 42.55,42.98 41.54,42.98 R2.1
N$7
  Top 0.203: U4.3 12.08,6.65 C9.1
N$9
  Top 0.152: U4.16 17.3,7.65 17.83,8.18 C2.1 21.25,6.55 R18.2
N$10
  Top 0.152: U4.13 19.2,6.15 R18.1 19.55,4.8 R5.2
RESET
  Top 0.635: RESET1.2 RESET1.1 9.92,20.57 C15.2 U3.P$6
SCL
  Top 0.254: U1.11 30.37,34.65 29.84,35.18 21.97,35.18 21.46,35.69 21.46,37.72 20.95,38.23 6.6,38.23 6.28,37.9 U3.P$30
SCL_AUX
  Top 0.254: 43.17,36.96 R8.1 45.81,36.95 J1.4 47.62,36.96 48.01,37.34 48.01,39.37 47.62,39.75 45.21,39.75 44.98,39.98 U9.3
SCL_OUT  (via drill 0.25, 0.38)
  Top 0.152: v37.21,40.73 39.46,40.73 39.62,40.89 39.62,41.58 40.01,41.96 U9.13 | v37.69,48.06 40.33,48.06
  Top 0.254: 40.33,48.06 U10.2 | R1.1 31.39,29.95 30.99,30.35 30.99,32.43 U1.10 31.02,39.15 v31.37,39.5
  Bottom 0.254: v37.69,48.06 37.21,47.57 v37.21,40.73 37.08,40.6 34.53,40.6 34.31,40.39 34.31,39.73 34.08,39.5 v31.37,39.5
SDA  (via drill 0.35, 0.38)
  Top 0.254: U3.P$8 12.53,23.96 v12.7,24.13 | U1.3 29.69,24.56 29.26,24.13 v20.85,24.13
  Bottom 0.254: v12.7,24.13 v20.85,24.13
SDA_AUX
  Top 0.254: J1.3 43.22,34.42 R9.1 42.38,34.38 42.11,34.65 42.11,39.02 42.56,39.48 44.1,39.48 44.5,39.88 44.5,40.76 U9.2
SDA_OUT
  Top 0.152: U9.14 41.33,41.46 41.15,41.27 | U10.4 36.39,46.55
  Top 0.254: 41.15,41.27 41.15,39.88 39.88,38.61 39.12,38.61 38.73,38.23 | 36.39,46.55 36.07,46.23 36.07,38.73 36.32,38.48 38.48,38.48 38.73,38.23 | U1.4 30.35,20.58 30.73,20.19 34.87,20.19 35.23,20.55 | 35.23,20.55 R6.1 | 35.23,20.55 35.33,20.55 35.81,20.07 38.35,20.07 38.73,20.45 38.73,38.23
SENSOR_EN1
  Top 0.254: 31.34,24.37 R4.2 | 31.28,24.43 R4.2 | R4.2 31.47,25.25 | U1.6 31.65,25.43 31.47,25.25 | 31.47,25.25 31.34,25.25 31,25.59 U1.5 31,28.56 30.73,28.83 30.23,28.83 29.72,29.34 U1.12 29.72,33.48 | U1.13 29.07,33.52 29.18,33.63 29.57,33.63 29.72,33.48 | U3.P$27 10.03,37.21 10.41,37.59 20.68,37.59 21.06,37.21 21.06,35.52 21.8,34.77 29.23,34.77 29.72,34.29 29.72,33.48
V_BATT  (via drill 0.25, 0.3)
  Top 0.203: U4.19 15.27,8.86 15.24,8.89 14.86,8.89 | U4.20 14.77,8.8 14.86,8.89 | 14.86,8.89 v14.22,8.89 14.1,9.02 13.72,9.02 v13.59,8.89
  Top 0.254: U4.14 17.99,6.65 18,6.63 v18.43,6.63
  Top 0.635: Q1.2 18.64,1.44 C11.1 18.18,1.91 v17.53,1.91
  Bottom 0.254: 18.8,7.24 18.29,6.73 18.29,6.63 18.29,6.61 18.29,6.48 18.8,5.97
  Bottom 0.635: v17.53,1.91 18.8,3.17 18.8,5.97 18.8,6.48 | v13.59,8.89 18.03,8.89 18.8,8.13 18.8,7.24 18.8,6.48 | v18.43,6.63 18.29,6.63 | 18.29,6.61 18.66,6.61 18.8,6.48
  pour Top (no thermals): 15.24,9.02 14.48,9.02 14.22,9.27 13.46,9.27 13.34,9.14 13.34,8.64 13.59,8.38 14.61,8.38 14.73,8.26 15.24,8.26 15.37,8.38 15.37,8.89
VCC  (via drill 0.25, 0.3)
  Top 0.203: U4.4 13.52,6.15 13.34,5.97 13.34,5.84 13.53,5.65 U4.5
  Top 0.254: U4.8 15.27,3.58 v15.24,3.56 | U4.11 17.72,5.15 17.91,5.33 v17.91,5.46 17.72,5.65 U4.12
  Top 0.635: 13.34,5.84 12.65,5.16 C10.1 12,4.25 v11.94,4.19
  Bottom 0.254: 14.61,4.45 14.99,4.06 15.24,4.06 15.49,4.06 15.88,4.45
  Bottom 0.635: v11.94,4.19 12.19,4.45 14.61,4.45 15.24,4.45 | v17.91,5.46 17.91,4.83 17.53,4.45 15.88,4.45 15.24,4.45 | v15.24,3.56 15.24,4.06 15.24,4.45
VCC_1  (via drill 0.38)
  Top 0.152: U10.6 42.22,47.3 | U10.1 41.34,48.37 40.98,48.73 | U9.8 C7.1 | U9.11 43.98,44.41 | U9.5 46.54,41.46 46.86,41.78
  Top 0.254: C1.1 40.98,50.74 40.66,51.05 v40.01,51.05 | 42.22,47.3 42.29,47.37 42.29,49.17 41.94,49.53 C1.1 | 40.98,48.73 C1.1 | R2.2 41.44,44.58 v40.01,44.58 | C7.1 | 43.98,44.41 44.3,44.73 C7.1 | C7.1 | C7.1 44.42,44.73 43.94,45.21 v43.94,45.72 | 46.86,41.78 v46.86,42.42 | 37.05,29.97 R1.2 | C12.1 48.3,31.88 J1.2 45.16,31.88 44.36,32.68 R9.2 | U1.1 28.4,27.33 28.04,27.69 26.81,27.69 C16.2 v26.8,28.96 | U9.1 43.98,40.3 43.56,39.88 42.4,39.88 42.39,39.88 v41.78,39.88
  Top 0.508: v47.19,38.68 43.22,38.68 R8.2
  Top 0.635: R6.2 36.92,29.84 37.05,29.97 | R1.2 37.02,31.81 v36.96,31.88
  Bottom 0.254: 40.01,46.48 40.51,45.97 | 40.51,45.97 43.69,45.97 v43.94,45.72 44.07,45.85 46.53,45.85 46.86,45.52 v46.86,42.42 | 40.51,45.97 40.01,45.47 | v41.78,39.88 40.77,39.88 40.01,40.64
  Bottom 0.635: v40.01,51.05 40.01,46.48 40.01,45.47 v40.01,44.58 40.01,40.64 39.37,40.01 35.43,40.01 34.92,39.5 34.92,34.65 34.19,33.91 | v47.19,38.68 47.78,38.68 48.51,37.95 48.51,32.51 47.88,31.88 J1.2 v36.96,31.88 36.22,31.88 34.19,33.91 | v26.8,28.96 26.8,33.15 27.56,33.91 34.19,33.91
VDD  (via drill 0.3, 0.38)
  Top 0.203: U4.2 13.55,7.15 13.46,7.24
  Top 0.254: v29.06,30.61 28.42,31.24 U1.14 28.42,33.07 28.08,33.41 C13.1 | R12.2 20.93,20.68 v21.21,20.95 | U1.2 v29.05,27.93 v29.06,27.94
  Top 0.305: U1.14 28.36,32.4
  Top 0.381: 12.03,9.79 C6.2 | 13.02,7.68 13.46,7.24
  Top 0.635: 12.03,9.79 C14.1 12.42,8.28 13.02,7.68 | v13.08,1.52 13.04,1.56 R7.2 | C6.2 v12.05,10.78 v12.06,10.79 | v4.95,12.83 4.95,14.41 C5.2 C4.2 5.04,16.05 C3.2 5.04,22.67 U3.P$2
  Bottom 0.508: 19.81,8.64 20.45,9.27
  Bottom 0.635: v13.08,1.52 13.59,1.02 18.16,1.02 19.81,2.67 19.81,8.64 18.54,9.91 12.95,9.91 | v12.06,10.79 12.95,9.91 | 12.95,9.91 5.66,9.91 4.95,10.62 v4.95,12.83 | v29.06,30.61 v29.06,27.94 29.06,25.43 27.51,23.88 22.73,23.88 21.21,22.35 v21.21,20.95 21.21,10.03 20.45,9.27

### Text on the board
bNames: WHT | BLU | BRN | BLK | 12-6-2020 | STWIN iNEMO IMU Node